# Altium schematic sheet Battery.SchDoc
size A4
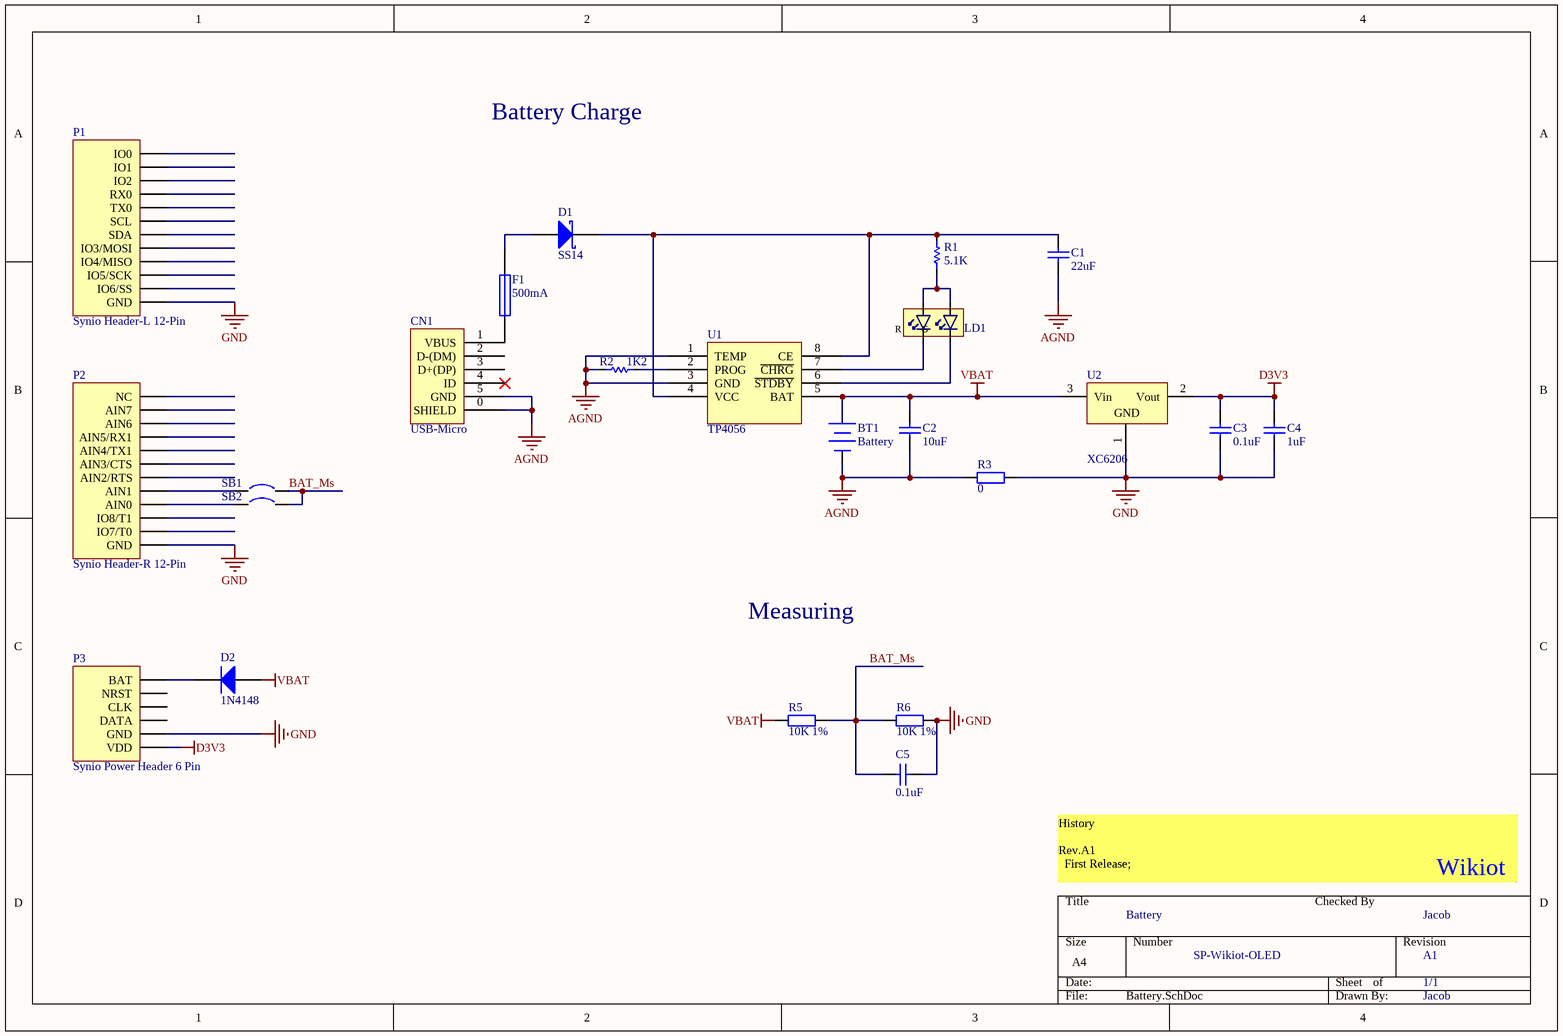
[diagram p0: Battery.SchDoc]

## Parts
?  LOGO  [Logo]  (value not drawn)
BT1  Battery  [HDR1X2/2.54mm]
C1  22uF  [0805]
C2  10uF  [0603C]
C3  0.1uF  [0603C]
C4  1uF  [0603C]
C5  0.1uF  [0603C]
CN1  USB-Micro  [USB-MICRO-Female-Lite]
D1  SS14  [SMB]
D2  1N4148  [SOD80]
F1  500mA  [0805]
LD1  LTST-C195KGJRKT  [0805-LED-Bi]  (value not drawn)
P1  Synio Header-L 12-Pin  [HDR1X12/2.54MM]
P2  Synio Header-R 12-Pin  [HDR1X12/2.54MM]
P3  Synio Power Header 6 Pin  [HDR1X6/2.54MM]
R1  5.1K  [0603M]
R2  1K2  [0603M]
R3  0  [0603M]
R5  10K 1%  [0603M]
R6  10K 1%  [0603M]
SB1  Circuit Breaker  [JP2_SMD]  (value not drawn)
SB2  Circuit Breaker  [JP2_SMD]  (value not drawn)
U1  TP4056  [SO8_M]
U2  XC6206  [SOT-23A]

## Nets
AGND: BT1.2(-) C1.2 C2.1 CN1.0(SHIELD) CN1.5(GND) R2.1 R3.1 U1.1(TEMP) U1.3(GND)
D3V3: C3.2 C4.2 P3.1(VDD) U2.2(Vout)
GND: C3.1 C4.1 C5.1 P1.1(GND) P2.1(GND) P3.2(GND) R3.2 R6.2 U2.1(GND/ADJUST)
VBAT: BT1.1(+) C2.2 D2.1(A) R5.1 U1.5(BAT) U2.3(Vin)
BAT_Ms: C5.2 R5.2 R6.1 SB1.2 SB2.2
NetC1_1: C1.1 D1.2(K) R1.2 U1.4(VCC) U1.8(CE)
NetCN1_1: CN1.1(VBUS) F1.2
NetD1_1: D1.1(A) F1.1
NetD2_2: D2.2(K) P3.6(BAT)
NetLD1_1: LD1.1(C1) U1.6(~{STDBY})
NetLD1_2: LD1.2(C2) U1.7(~{CHRG})
NetLD1_3: LD1.3(A2) LD1.4(A1) R1.1
NetP2_4: P2.4(AIN0) SB2.1
NetP2_5: P2.5(AIN1) SB1.1
NetR2_2: R2.2 U1.2(PROG)

Not connected (* = marked no-connect by the designer): CN1 2(D-(DM)) 3(D+(DP)) 4(ID)*; P1 2(IO6/SS) 3(IO5/SCK) 4(IO4/MISO) 5(IO3/MOSI) 6(SDA) 7(SCL) 8(TX0) 9(RX0) 10(IO2) 11(IO1) 12(IO0); P2 2(IO7/T0) 3(IO8/T1) 6(AIN2/RTS) 7(AIN3/CTS) 8(AIN4/TX1) 9(AIN5/RX1) 10(AIN6) 11(AIN7) 12(NC); P3 3(DATA) 4(CLK) 5(NRST)

## Notes on the sheet
- Battery Charge
- Measuring
- History
  Rev.A1
  First Release;
- Battery
- Checked By
- Jacob
- SP-Wikiot-OLED
- A1
- 1/1
- (in symbol LED-DUAL) R; G
- (in symbol LOGO) Wikiot
- (in symbol XC6206) GND

## Library data of the parts
BT1 = Battery: Multicell Battery; Published: 24-Mar-1999; LatestRevisionDate: 17-Jul-2002; LatestRevisionNote: Re-released for DXP Platform.; PackageReference: BAT-2; Publisher: Altium Limited; PackageDescription: Battery; 2 Leads
C1-C5 = Cap: Capacitor; Published: 8-Jun-2000; LatestRevisionDate: 17-Jul-2002; LatestRevisionNote: Re-released for DXP Platform.; PackageReference: RAD-0.3
  C1: Publisher: Altium Limited; Value: 22uF
  C2: Value: 10uF
  C3 C5: Value: 0.1uF
  C4: Value: 1uF
D1 = D Schottky: Schottky Diode; Published: 8-Jun-2000; LatestRevisionDate: 17-Jul-2002; LatestRevisionNote: Re-released for DXP Platform.; PackageReference: SMB; Publisher: Altium Limited; PackageDescription: DO-214-AA/SMB; 2 C-Bend Leads; Body 5.3 x 3.6 mm, inc. leads (LxW); Code_JEDEC: DO-214-AA
D2 = Diode 1N4148: High Conductance Fast Diode; Published: 8-Jun-2000; LatestRevisionDate: 17-Jul-2002; LatestRevisionNote: Re-released for DXP Platform.; DatasheetVersion: 1997; PackageReference: DO-35; Publisher: Altium Limited; PackageDescription: Diode, Axial; Body 3.8 x 1.9 mm (LxDia. max), Lead Dia. 0.53 mm (max); Code_JEDEC: DO-204-AH; ComponentLink1Description: Manufacturer Link; ComponentLink1URL: http://www.fairchildsemi.com/; ComponentLink2Description: Datasheet; ComponentLink2URL: http://www.fairchildsemi.com/ds/1N%2F1N4148.pdf
F1 = Fuse 1: Fuse; Published: 8-Jun-2000; LatestRevisionDate: 17-Jul-2002; LatestRevisionNote: Re-released for DXP Platform.; PackageReference: PIN-W2/E2.8; Publisher: Altium Limited; PackageDescription: Thru-Hole; 2 Leads
LD1 = LED-DUAL: Avago, HSMF-A203 Bi-Color LED; Manufacturer: Lite-On Inc; 2nd source part number: 859-LTST-C195KGJRKT; Note: HSMF-A203- xxxxx GaP Red GaP Emerald Green; Artikkelnr Noca: 13019145; Part Number: LTST-C195KGJRKT; Manufacturer Part Number: LTST-C195KGJRKT; Datasheet: http://media.digikey.com/pdf/Data%20Sheets/Lite-On%20PDFs/LTST-C195KGJRKT.pdf; Footprint: LED_DUAL_0606; LatestRevisionDate: 2012-07-05; Pin Count: 4; Publisher: Nordic Semiconductor; Published: 2012-07-05; Value: LTST-C195KGJRKT; Supplier: Digi-Key; Supplier part number: 160-1452-1-ND; 2nd source Supplier: Mouser
P1 = Synio Header-L 12-Pin: Synio Header-L, 12-Pin; LatestRevisionDate: 17-Jul-2002; LatestRevisionNote: Re-released for DXP Platform.; Publisher: Altium Limited
P2 = Synio Header-R 12-Pin: Synio Header-R, 12-Pin; LatestRevisionDate: 17-Jul-2002; LatestRevisionNote: Re-released for DXP Platform.; Publisher: Altium Limited
R1 R2 = Res1: Resistor; Published: 8-Jun-2000; Revision: July-2002: Re-released for DXP Platform.; Publisher: Altium Limited
  R1: Value: 5.1K
  R2: Value: 1K2
R3 R5 R6 = Res2: Resistor; Published: 8-Jun-2000; LatestRevisionDate: 17-Jul-2002; LatestRevisionNote: Re-released for DXP Platform.; PackageReference: AXIAL-0.4; Publisher: Altium Limited
  R3: Value: 0
  R5 R6: Value: 10K 1%
SB1 SB2 = Circuit Breaker: Solder: YES; Published: 24-Mar-1999; Revision: July-2002: Re-released for DXP Platform.; Publisher: Altium Limited
U1 = Li-Charging IC
U2 = XC6206: Published: 24-Mar-1999; LatestRevisionDate: 29-May-2009; LatestRevisionNote: IPC-7351 Footprint Added.; PackageReference: D2PAK; Publisher: Altium Limited; PackageDescription: 3-Pin Transistor Outline Package 2.54 mm Pitch, 15.1 mm Lead Span